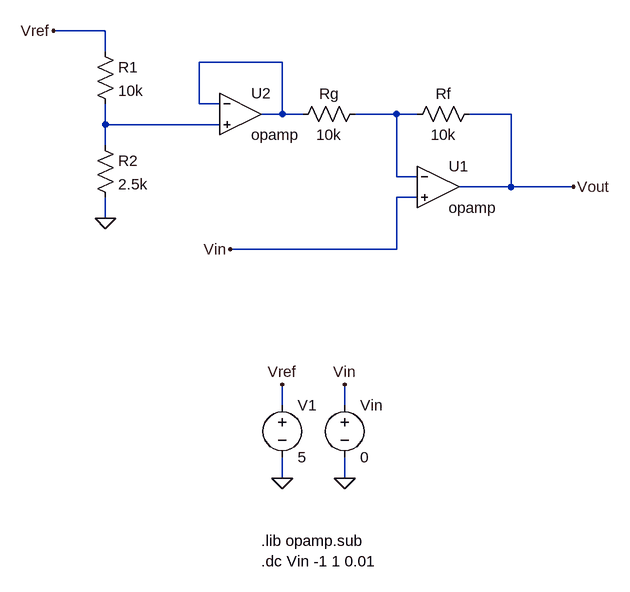
[diagram p0: schematic mpbne.asc]
mpbne.asc, the LTspice schematic file:
Version 4
SHEET 1 880 800
WIRE -304 -64 -384 -64
WIRE -304 -32 -304 -64
WIRE -32 -16 -160 -16
WIRE -160 48 -160 -16
WIRE -128 48 -160 48
WIRE -32 64 -32 -16
WIRE -32 64 -64 64
WIRE 0 64 -32 64
WIRE 144 64 80 64
WIRE 176 64 144 64
WIRE 320 64 256 64
WIRE -304 80 -304 48
WIRE -128 80 -304 80
WIRE -304 112 -304 80
WIRE 144 160 144 64
WIRE 176 160 144 160
WIRE 320 176 320 64
WIRE 320 176 240 176
WIRE 416 176 320 176
WIRE 176 192 144 192
WIRE -304 224 -304 192
WIRE 144 272 144 192
WIRE 144 272 -112 272
WIRE -32 512 -32 480
WIRE 64 512 64 480
WIRE -32 624 -32 592
WIRE 64 624 64 592
FLAG -32 480 Vref
FLAG -32 624 0
FLAG 64 624 0
FLAG -384 -64 Vref
FLAG 416 176 Vout
FLAG -304 224 0
FLAG -112 272 Vin
FLAG 64 480 Vin
SYMBOL voltage 64 496 R0
SYMATTR InstName Vin
SYMATTR Value 0
SYMBOL res 272 48 R90
WINDOW 0 0 56 VBottom 2
WINDOW 3 32 56 VTop 2
SYMATTR InstName Rf
SYMATTR Value 10k
SYMBOL res 96 48 R90
WINDOW 0 0 56 VBottom 2
WINDOW 3 32 56 VTop 2
SYMATTR InstName Rg
SYMATTR Value 10k
SYMBOL res -320 96 R0
SYMATTR InstName R2
SYMATTR Value 2.5k
SYMBOL res -320 -48 R0
SYMATTR InstName R1
SYMATTR Value 10k
SYMBOL voltage -32 496 R0
SYMATTR InstName V1
SYMATTR Value 5
SYMBOL Opamps\\opamp 208 112 R0
SYMATTR InstName U1
SYMBOL Opamps\\opamp -96 0 R0
SYMATTR InstName U2
TEXT -64 752 Left 2 !.dc Vin -1 1 0.01
TEXT -64 720 Left 2 !.lib opamp.sub

The netlist it stands for:
* mpbne.asc
Vin Vin 0 0
Rf Vout N002 10k
Rg N002 N001 10k
R2 N003 0 2.5k
R1 Vref N003 10k
V1 Vref 0 5
XU1 N002 Vin Vout opamp Aol=100K GBW=10Meg  ; pins invin noninvin out
XU2 N001 N003 N001 opamp Aol=100K GBW=10Meg  ; pins invin noninvin out
.dc Vin -1 1 0.01
.lib opamp.sub
.backanno
.end